# EAGLE schematic Memory V1.0 (EAGLE 9.6.2)

## Sheet 1 of 5: BUS
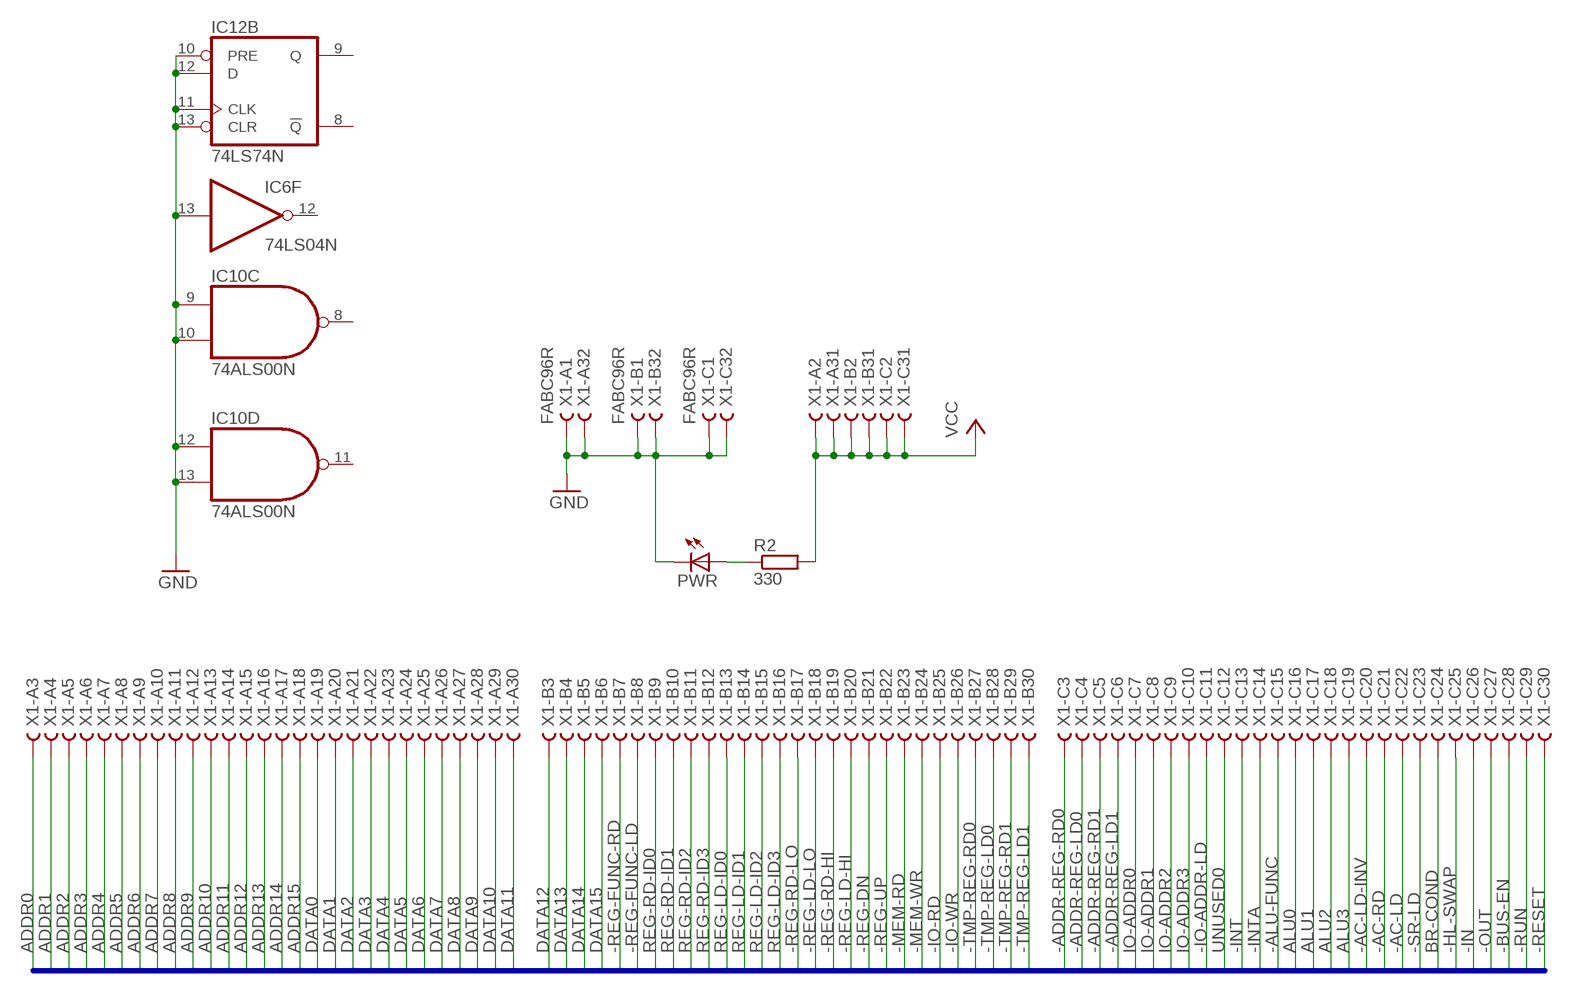
[diagram p0: schematic, sheet 1]

### Parts
IC6  74LS04N  [DIL14]
IC10  74ALS00N  [DIL14]
IC12  74LS74N  [DIL14]
PWR  LED5MM  [LED5MM]
R2  330  R0207/10  [0207/10]
X1  FABC96R  [FABC96R]

### Nets
-AC-LD: X1.C22
-AC-LD-INV: X1.C20
-AC-RD: X1.C21
-ADDR-REG-LD0: X1.C4
-ADDR-REG-LD1: X1.C6
-ADDR-REG-RD0: X1.C3
-ADDR-REG-RD1: X1.C5
-ALU-FUNC: X1.C15
-BUS-EN: X1.C28
-HL-SWAP: X1.C25
-IN: X1.C26
-INT: X1.C13
-INTA: X1.C14
-IO-ADDR-LD: X1.C11
-IO-RD: X1.B25
-IO-WR: X1.B26
-MEM-RD: X1.B23 ; also sheet 3,5
-MEM-WR: X1.B24 ; also sheet 3,5
-OUT: X1.C27
-REG-DN: X1.B21
-REG-FUNC-LD: X1.B8
-REG-FUNC-RD: X1.B7
-REG-LD-HI: X1.B20
-REG-LD-LO: X1.B18
-REG-RD-HI: X1.B19
-REG-RD-LO: X1.B17
-REG-UP: X1.B22
-RESET: X1.C30 ; also sheet 2
-RUN: X1.C29
-SR-LD: X1.C23
-TMP-REG-LD0: X1.B28
-TMP-REG-LD1: X1.B30
-TMP-REG-RD0: X1.B27
-TMP-REG-RD1: X1.B29
ADDR0: X1.A3 ; also sheet 4
ADDR1: X1.A4 ; also sheet 4
ADDR2: X1.A5 ; also sheet 4
ADDR3: X1.A6 ; also sheet 4
ADDR4: X1.A7 ; also sheet 4
ADDR5: X1.A8 ; also sheet 4
ADDR6: X1.A9 ; also sheet 4
ADDR7: X1.A10 ; also sheet 4
ADDR8: X1.A11 ; also sheet 4
ADDR9: X1.A12 ; also sheet 4
ADDR10: X1.A13 ; also sheet 4
ADDR11: X1.A14 ; also sheet 4
ADDR12: X1.A15 ; also sheet 4
ADDR13: X1.A16 ; also sheet 4
ADDR14: X1.A17 ; also sheet 4
ADDR15: X1.A18 ; also sheet 4
ALU0: X1.C16
ALU1: X1.C17
ALU2: X1.C18
ALU3: X1.C19
BR-COND: X1.C24
DATA0: X1.A19 ; also sheet 5
DATA1: X1.A20 ; also sheet 5
DATA2: X1.A21 ; also sheet 5
DATA3: X1.A22 ; also sheet 5
DATA4: X1.A23 ; also sheet 5
DATA5: X1.A24 ; also sheet 5
DATA6: X1.A25 ; also sheet 5
DATA7: X1.A26 ; also sheet 5
DATA8: X1.A27
DATA9: X1.A28
DATA10: X1.A29
DATA11: X1.A30
DATA12: X1.B3
DATA13: X1.B4
DATA14: X1.B5
DATA15: X1.B6
GND: IC6.13(F:I) IC10.9(C:I0) IC10.10(C:I1) IC10.12(D:I0) IC10.13(D:I1) IC12.10(B:PRE) IC12.11(B:CLK) IC12.12(B:D) IC12.13(B:CLR) PWR.K(C) X1.A1 X1.A32 X1.B1 X1.B32 X1.C1 X1.C32 ; also sheet 2,3,4
IO-ADDR0: X1.C7
IO-ADDR1: X1.C8
IO-ADDR2: X1.C9
IO-ADDR3: X1.C10
N$11: PWR.A R2.1
REG-LD-ID0: X1.B13
REG-LD-ID1: X1.B14
REG-LD-ID2: X1.B15
REG-LD-ID3: X1.B16
REG-RD-ID0: X1.B9
REG-RD-ID1: X1.B10
REG-RD-ID2: X1.B11
REG-RD-ID3: X1.B12
UNUSED0: X1.C12
VCC: R2.2 X1.A2 X1.A31 X1.B2 X1.B31 X1.C2 X1.C31 ; also sheet 2,3,4,5
Unconnected: IC6.12(F:O) IC10.8(C:O) IC10.11(D:O) IC12.8(B:!Q) IC12.9(B:Q)

### Buses
MAINBUS:-AC-LD,-AC-LD-INV,-AC-RD,ADDR[0..15],-ADDR-REG-LD[0..1],-ADDR-REG-RD[0..1],ALU[0..3],-ALU-FUNC,BR-COND,-BUS-EN,DATA[0..15],-HL-SWAP,-IN,-INT,-INTA,IO-ADDR[0..3],-IO-ADDR-LD,-IO-RD,-IO-WR,-MEM-RD,-MEM-WR,-OUT,-REG-DN,-REG-FUNC-LD,-REG-FUNC-RD,-REG-LD-HI,REG-LD-ID[0..3],-REG-LD-LO,-REG-RD-HI,REG-RD-ID[0..3],-REG-RD-LO,-REG-UP,-RESET,-RUN,-SR-LD,-TMP-REG-LD[0..1],-TMP-REG-RD[0..1],UNUSED0

## Sheet 2 of 5: Memory Select
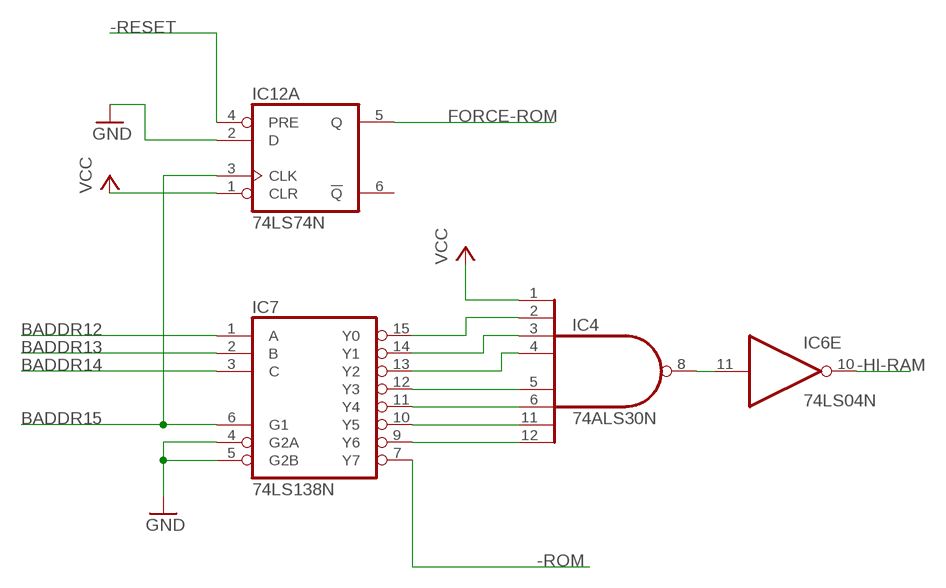
[diagram p1: schematic, sheet 2]

### Parts
IC4  74ALS30N  [DIL14]
IC7  74LS138N  [DIL16]

### Nets
-HI-RAM: IC6.10(E:O) ; also sheet 3
-RESET: IC12.4(A:PRE) ; also sheet 1
-ROM: IC7.7(Y7) ; also sheet 3
BADDR12: IC7.1(A) ; also sheet 3,4
BADDR13: IC7.2(B) ; also sheet 3,4
BADDR14: IC7.3(C) ; also sheet 3,4
BADDR15: IC7.6(G1) IC12.3(A:CLK) ; also sheet 3,4
FORCE-ROM: IC12.5(A:Q) ; also sheet 4
GND: IC7.4(G2A) IC7.5(G2B) IC12.2(A:D) ; also sheet 1,3,4
N$1: IC4.12(I7) IC7.9(Y6)
N$5: IC4.11(I6) IC7.10(Y5)
N$6: IC4.6(I5) IC7.11(Y4)
N$7: IC4.5(I4) IC7.12(Y3)
N$8: IC4.4(I3) IC7.13(Y2)
N$9: IC4.3(I2) IC7.14(Y1)
N$10: IC4.2(I1) IC7.15(Y0)
N$14: IC4.8(O) IC6.11(E:I)
VCC: IC4.1(I0) IC12.1(A:CLR) ; also sheet 1,3,4,5
Unconnected: IC12.6(A:!Q)

## Sheet 3 of 5: Memory
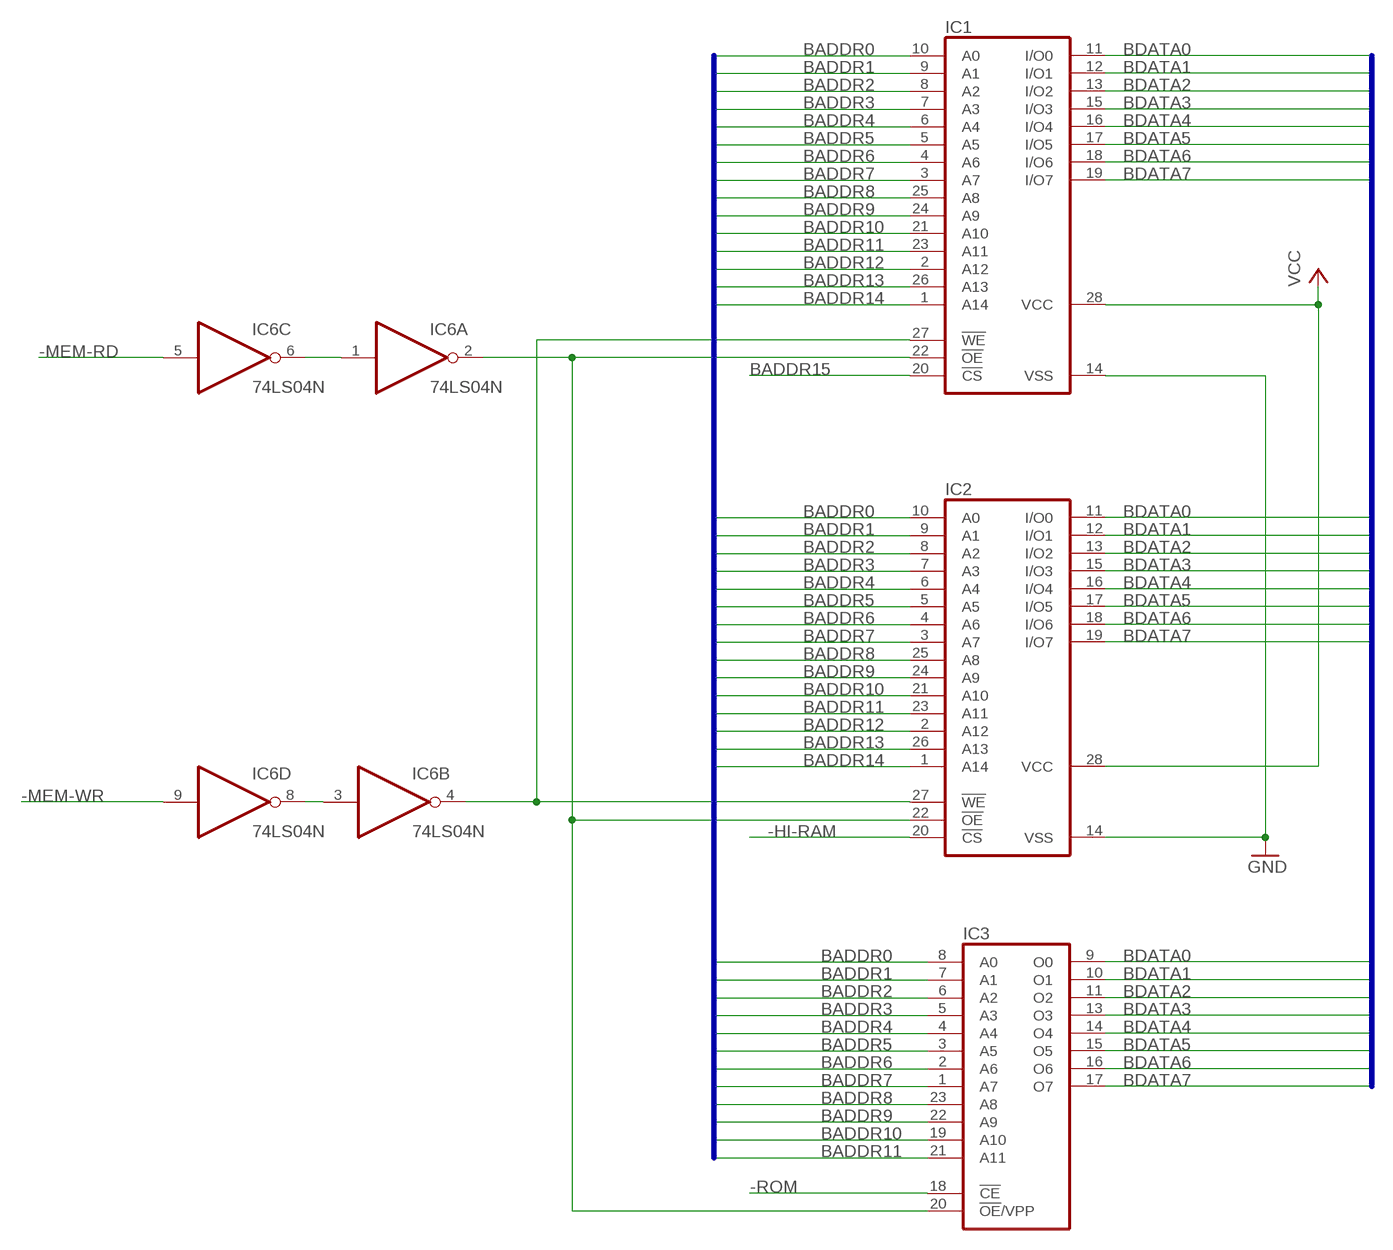
[diagram p2: schematic, sheet 3]

### Parts
IC1  62256P  [DIL28-6]
IC2  62256P  [DIL28-6]
IC3  2732  [DIL24]

### Nets
-HI-RAM: IC2.20(!CS) ; also sheet 2
-MEM-RD: IC6.5(C:I) ; also sheet 1,5
-MEM-WR: IC6.9(D:I) ; also sheet 1,5
-ROM: IC3.18(!CE) ; also sheet 2
BADDR0: IC1.10(A0) IC2.10(A0) IC3.8(A0) ; also sheet 4
BADDR1: IC1.9(A1) IC2.9(A1) IC3.7(A1) ; also sheet 4
BADDR2: IC1.8(A2) IC2.8(A2) IC3.6(A2) ; also sheet 4
BADDR3: IC1.7(A3) IC2.7(A3) IC3.5(A3) ; also sheet 4
BADDR4: IC1.6(A4) IC2.6(A4) IC3.4(A4) ; also sheet 4
BADDR5: IC1.5(A5) IC2.5(A5) IC3.3(A5) ; also sheet 4
BADDR6: IC1.4(A6) IC2.4(A6) IC3.2(A6) ; also sheet 4
BADDR7: IC1.3(A7) IC2.3(A7) IC3.1(A7) ; also sheet 4
BADDR8: IC1.25(A8) IC2.25(A8) IC3.23(A8) ; also sheet 4
BADDR9: IC1.24(A9) IC2.24(A9) IC3.22(A9) ; also sheet 4
BADDR10: IC1.21(A10) IC2.21(A10) IC3.19(A10) ; also sheet 4
BADDR11: IC1.23(A11) IC2.23(A11) IC3.21(A11) ; also sheet 4
BADDR12: IC1.2(A12) IC2.2(A12) ; also sheet 2,4
BADDR13: IC1.26(A13) IC2.26(A13) ; also sheet 2,4
BADDR14: IC1.1(A14) IC2.1(A14) ; also sheet 2,4
BADDR15: IC1.20(!CS) ; also sheet 2,4
BDATA0: IC1.11(I/O0) IC2.11(I/O0) IC3.9(O0) ; also sheet 5
BDATA1: IC1.12(I/O1) IC2.12(I/O1) IC3.10(O1) ; also sheet 5
BDATA2: IC1.13(I/O2) IC2.13(I/O2) IC3.11(O2) ; also sheet 5
BDATA3: IC1.15(I/O3) IC2.15(I/O3) IC3.13(O3) ; also sheet 5
BDATA4: IC1.16(I/O4) IC2.16(I/O4) IC3.14(O4) ; also sheet 5
BDATA5: IC1.17(I/O5) IC2.17(I/O5) IC3.15(O5) ; also sheet 5
BDATA6: IC1.18(I/O6) IC2.18(I/O6) IC3.16(O6) ; also sheet 5
BDATA7: IC1.19(I/O7) IC2.19(I/O7) IC3.17(O7) ; also sheet 5
GND: IC1.14(VSS) IC2.14(VSS) ; also sheet 1,2,4
MEM-RD: IC6.1(A:I) IC6.6(C:O)
N$2: IC6.3(B:I) IC6.8(D:O)
N$3: IC1.22(!OE) IC2.22(!OE) IC3.20(!OE!/VPP) IC6.2(A:O)
N$4: IC1.27(!WE) IC2.27(!WE) IC6.4(B:O)
VCC: IC1.28(VCC) IC2.28(VCC) ; also sheet 1,2,4,5

### Buses
BADDR[0..15]
BDATA[0..7]

## Sheet 4 of 5: Adress Buffering
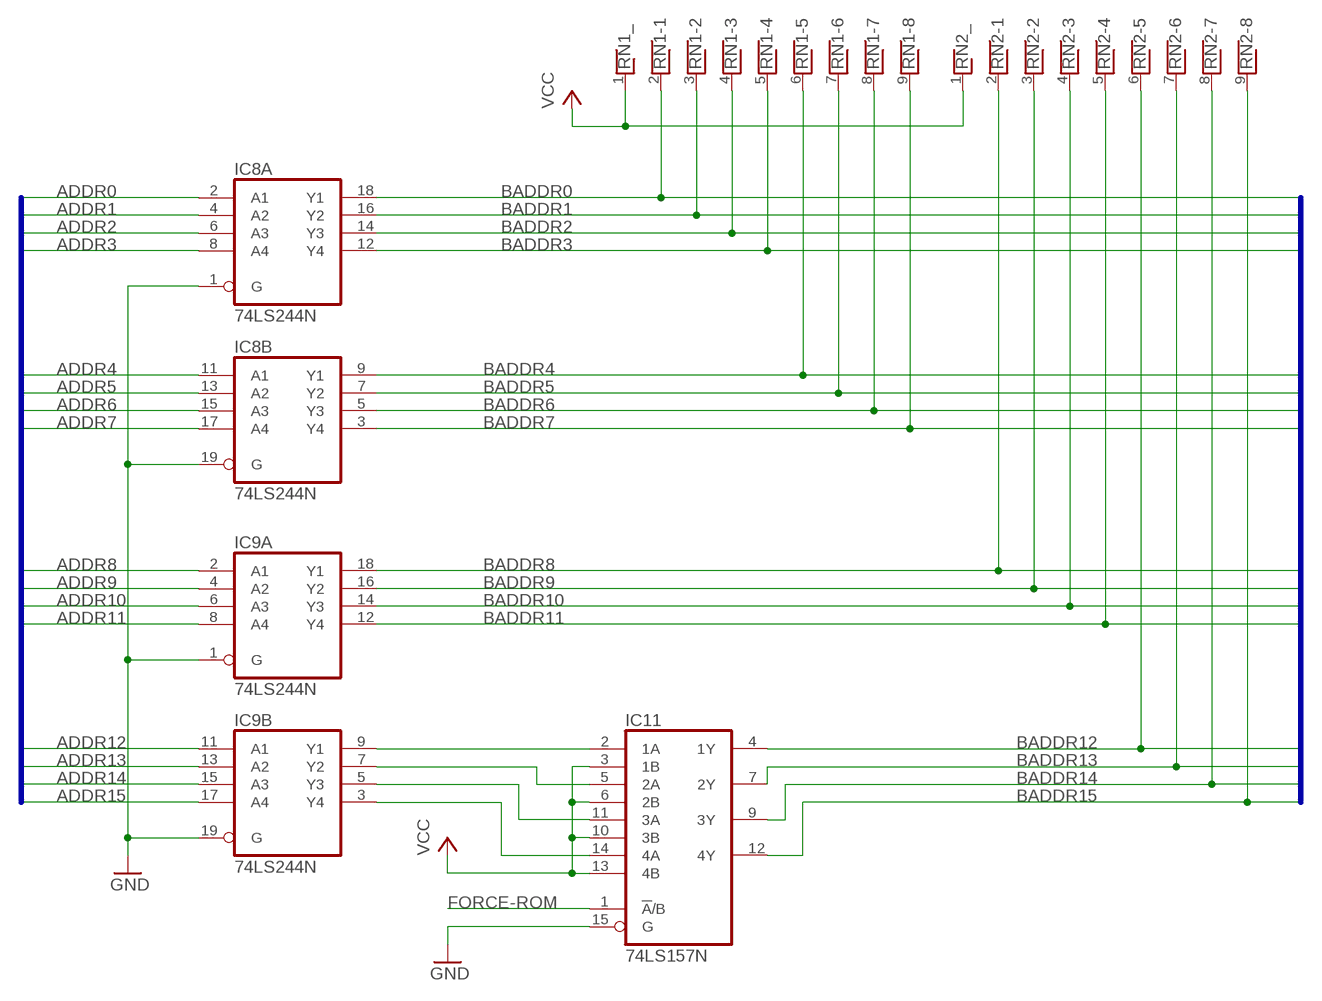
[diagram p3: schematic, sheet 4]

### Parts
IC8  74LS244N  [DIL20]
IC9  74LS244N  [DIL20]
IC11  74LS157N  [DIL16]
RN1  RNX8  [RN-9]
RN2  RNX8  [RN-9]

### Nets
ADDR0: IC8.2(A:A1) ; also sheet 1
ADDR1: IC8.4(A:A2) ; also sheet 1
ADDR2: IC8.6(A:A3) ; also sheet 1
ADDR3: IC8.8(A:A4) ; also sheet 1
ADDR4: IC8.11(B:A1) ; also sheet 1
ADDR5: IC8.13(B:A2) ; also sheet 1
ADDR6: IC8.15(B:A3) ; also sheet 1
ADDR7: IC8.17(B:A4) ; also sheet 1
ADDR8: IC9.2(A:A1) ; also sheet 1
ADDR9: IC9.4(A:A2) ; also sheet 1
ADDR10: IC9.6(A:A3) ; also sheet 1
ADDR11: IC9.8(A:A4) ; also sheet 1
ADDR12: IC9.11(B:A1) ; also sheet 1
ADDR13: IC9.13(B:A2) ; also sheet 1
ADDR14: IC9.15(B:A3) ; also sheet 1
ADDR15: IC9.17(B:A4) ; also sheet 1
BADDR0: IC8.18(A:Y1) RN1.2 ; also sheet 3
BADDR1: IC8.16(A:Y2) RN1.3 ; also sheet 3
BADDR2: IC8.14(A:Y3) RN1.4 ; also sheet 3
BADDR3: IC8.12(A:Y4) RN1.5 ; also sheet 3
BADDR4: IC8.9(B:Y1) RN1.6 ; also sheet 3
BADDR5: IC8.7(B:Y2) RN1.7 ; also sheet 3
BADDR6: IC8.5(B:Y3) RN1.8 ; also sheet 3
BADDR7: IC8.3(B:Y4) RN1.9 ; also sheet 3
BADDR8: IC9.18(A:Y1) RN2.2 ; also sheet 3
BADDR9: IC9.16(A:Y2) RN2.3 ; also sheet 3
BADDR10: IC9.14(A:Y3) RN2.4 ; also sheet 3
BADDR11: IC9.12(A:Y4) RN2.5 ; also sheet 3
BADDR12: IC11.4(1Y) RN2.6 ; also sheet 2,3
BADDR13: IC11.7(2Y) RN2.7 ; also sheet 2,3
BADDR14: IC11.9(3Y) RN2.8 ; also sheet 2,3
BADDR15: IC11.12(4Y) RN2.9 ; also sheet 2,3
FORCE-ROM: IC11.1(!A!/B) ; also sheet 2
GND: IC8.1(A:G) IC8.19(B:G) IC9.1(A:G) IC9.19(B:G) IC11.15(G) ; also sheet 1,2,3
N$15: IC9.9(B:Y1) IC11.2(1A)
N$16: IC9.7(B:Y2) IC11.5(2A)
N$17: IC9.5(B:Y3) IC11.11(3A)
N$18: IC9.3(B:Y4) IC11.14(4A)
VCC: IC11.3(1B) IC11.6(2B) IC11.10(3B) IC11.13(4B) RN1.1 RN2.1 ; also sheet 1,2,3,5

### Buses
ADDR0,ADDR1,ADDR2,ADDR3,ADDR4,ADDR5,ADDR6,ADDR7,ADDR8,ADDR9,ADDR10,ADDR11,ADDR12,ADDR13,ADDR14,ADDR15
BADDR[0..15]

## Sheet 5 of 5: Data Buffer
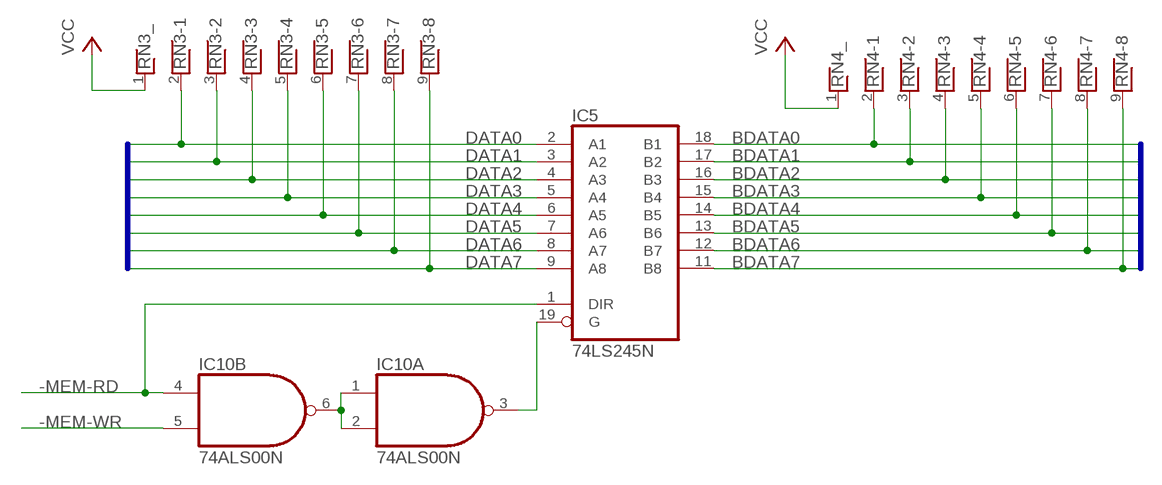
[diagram p4: schematic, sheet 5]

### Parts
IC5  74LS245N  [DIL20]
RN3  RNX8  [RN-9]
RN4  RNX8  [RN-9]

### Nets
-MEM-RD: IC5.1(DIR) IC10.4(B:I0) ; also sheet 1,3
-MEM-WR: IC10.5(B:I1) ; also sheet 1,3
BDATA0: IC5.18(B1) RN4.2 ; also sheet 3
BDATA1: IC5.17(B2) RN4.3 ; also sheet 3
BDATA2: IC5.16(B3) RN4.4 ; also sheet 3
BDATA3: IC5.15(B4) RN4.5 ; also sheet 3
BDATA4: IC5.14(B5) RN4.6 ; also sheet 3
BDATA5: IC5.13(B6) RN4.7 ; also sheet 3
BDATA6: IC5.12(B7) RN4.8 ; also sheet 3
BDATA7: IC5.11(B8) RN4.9 ; also sheet 3
DATA0: IC5.2(A1) RN3.2 ; also sheet 1
DATA1: IC5.3(A2) RN3.3 ; also sheet 1
DATA2: IC5.4(A3) RN3.4 ; also sheet 1
DATA3: IC5.5(A4) RN3.5 ; also sheet 1
DATA4: IC5.6(A5) RN3.6 ; also sheet 1
DATA5: IC5.7(A6) RN3.7 ; also sheet 1
DATA6: IC5.8(A7) RN3.8 ; also sheet 1
DATA7: IC5.9(A8) RN3.9 ; also sheet 1
N$12: IC10.1(A:I0) IC10.2(A:I1) IC10.6(B:O)
N$13: IC5.19(G) IC10.3(A:O)
VCC: RN3.1 RN4.1 ; also sheet 1,2,3,4

### Buses
DATA[0..7]
BDATA0,BDATA1,BDATA2,BDATA3,BDATA4,BDATA5,BDATA6,BDATA7

## Power pins joined to a net without a drawn wire
GND: IC3.12(GND) IC4.7(GND) IC5.10(GND) IC6.7(P:GND) IC7.8(GND) IC8.10(P:GND) IC9.10(P:GND) IC10.7(P:GND) IC11.8(GND) IC12.7(P:GND)
VCC: IC3.24(VCC) IC4.14(VCC) IC5.20(VCC) IC6.14(P:VCC) IC7.16(VCC) IC8.20(P:VCC) IC9.20(P:VCC) IC10.14(P:VCC) IC11.16(VCC) IC12.14(P:VCC)

## Library data of the parts
IC1 IC2 = memory-hitachi:62256P: MEMORY; OC_FARNELL: unknown; OC_NEWARK: unknown
IC3 = memory:2732: MEMORY
IC4 = 74xx-us:74*30: 8-input NAND gate
IC5 = adafruit:74*245: Octal BUS TRANSCEIVER, 3-state
IC6 = 74xx-us:74*04: Hex INVERTER
IC7 = 74xx-us:74*138: 3-line to 8-line DECODER/DEMULTIPLEXER
IC8 IC9 = 74xx-us:74*244: Octal BUFFER and LINE DRIVER, 3-state
IC10 = 74xx-us:74*00: Quad 2-input NAND gate
IC11 = 74xx-us:74*157: Quadruple 2-line to 1-line data SELECTOR/MULTIPLEXER
IC12 = 74xx-us:74*74: Dual D type positive edge triggered FLIP FLOP, preset and clear
PWR = led:LED: LED OSRAM: - CHIPLED LG R971, LG N971, LY N971, LG Q971, LY Q971, LO R971, LY R971 LH N974, LH R974 LS Q976, LO Q976, LY Q976 LO Q996 - Hyper CHIPLED LW Q18S LB Q993, LB Q99A, LB R99A - SideLED LS A670, LO A670, LY A670, LG A670, LP A670 LB A673, LV A673, LT A673, LW A673 LH A674 LY A675 LS A676, LA A676, LO A676, LY A676, LW A676 LS A679, LY A679, LG A679 - Hyper Micro SIDELED® LS Y876, LA Y876, LO Y876, LY Y876 LT Y87S - SmartLED LW L88C, LW L88S LB L89C, LB L89S, LG L890 LS L89K, LO L89K, LY L89K LS L896, LA L896, LO L896, LY L896 - TOPLED LS T670, LO T670, LY T670, LG T670, LP T670 LSG T670, LSP T670, LSY T670, LOP T670, LYG T670 LG T671, LOG T671, LSG T671 LB T673, LV T673, LT T673, LW T673 LH T674 LS T676, LA T676, LO T676, LY T676, LB T676, LH T676, LSB T676, LW T676 LB T67C, LV T67C, LT T67C, LS T67K, LO T67K, LY T67K, LW E67C LS E67B, LA E67B, LO E67B, LY E67B, LB E67C, LV E67C, LT E67C LW T67C LS T679, LY T679, LG T679 LS T770, LO T770, LY T770, LG T770, LP T770 LB T773, LV T773, LT T773, LW T773 LH T774 LS E675, LA E675, LY E675, LS T675 LS T776, LA T776, LO T776, LY T776, LB T776 LHGB T686 LT T68C, LB T68C - Hyper Mini TOPLED® LB M676 - Mini TOPLED Santana® LG M470 LS M47K, LO M47K, LY M47K Source: http://www.osram.convergy.de LUXEON: - LUMILED® LXK2-PW12-R00, LXK2-PW12-S00, LXK2-PW14-U00, LXK2-PW14-V00 LXK2-PM12-R00, LXK2-PM12-S00, LXK2-PM14-U00 LXK2-PE12-Q00, LXK2-PE12-R00, LXK2-PE12-S00, LXK2-PE14-T00, LXK2-PE14-U00 LXK2-PB12-K00, LXK2-PB12-L00, LXK2-PB12-M00, LXK2-PB14-N00, LXK2-PB14-P00, LXK2-PB14-Q00 LXK2-PR12-L00, LXK2-PR12-M00, LXK2-PR14-Q00, LXK2-PR14-R00 LXK2-PD12-Q00, LXK2-PD12-R00, LXK2-PD12-S00 LXK2-PH12-R00, LXK2-PH12-S00 LXK2-PL12-P00, LXK2-PL12-Q00, LXK2-PL12-R00 Source: www.luxeon.com KINGBRIGHT: KA-3528ASYC Source: www.kingbright.com
R2 = eagle-ltspice:R: RESISTOR, European symbol; SPICEMODEL: NONE; SPICEPREFIX: R
RN1-RN4 = resistor-net:RNX8: RESISTOR NETWORK; OC_FARNELL: unknown; OC_NEWARK: unknown
X1 = con-vg:FABC96R: CONNECTOR female, 96 pins, type R, rows ABC, grid 2.54 mm

## Net classes
1 GND: width 1 mm
2 5V: width 1 mm